# Altium schematic sheet PL_DDR4_SODIMM.SchDoc
size A3
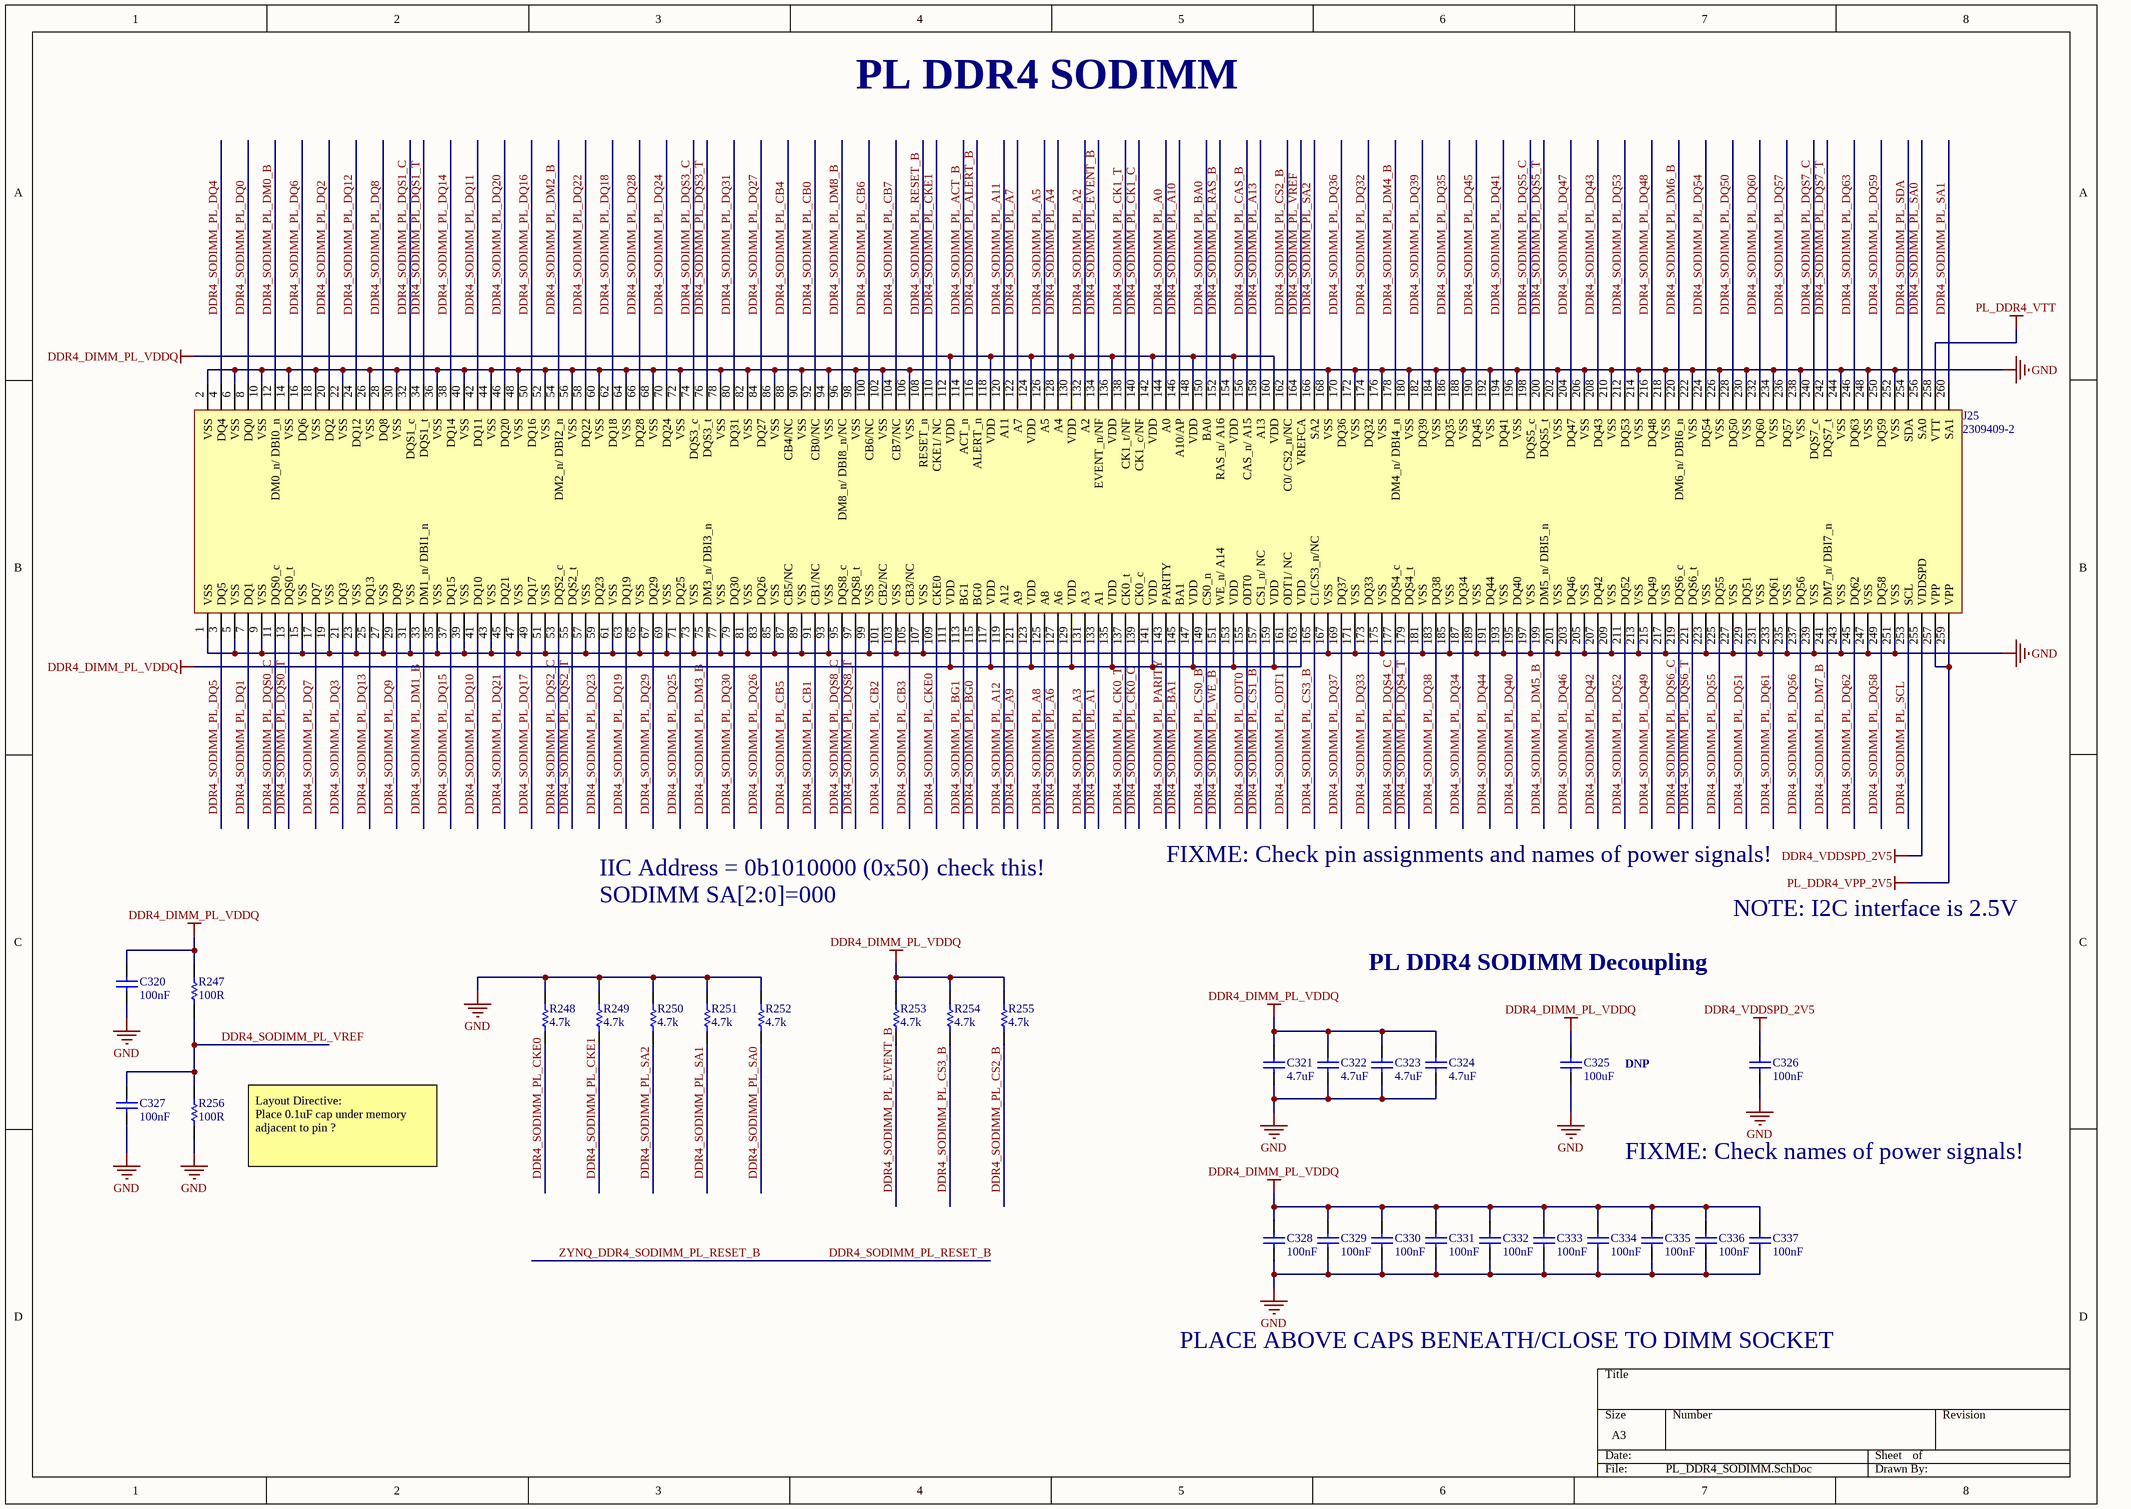
[diagram p0: PL_DDR4_SODIMM.SchDoc]

## Parts
C320  100nF  [CAPC1005L_0402]
C321  4.7uF  [CAPC1005L_0402]
C322  4.7uF  [CAPC1005L_0402]
C323  4.7uF  [CAPC1005L_0402]
C324  4.7uF  [CAPC1005L_0402]
C325  100uF  [CAPC3225N_1210]
C326  100nF  [CAPC1005L_0402]
C327  100nF  [CAPC1005L_0402]
C328  100nF  [CAPC1005L_0402]
C329  100nF  [CAPC1005L_0402]
C330  100nF  [CAPC1005L_0402]
C331  100nF  [CAPC1005L_0402]
C332  100nF  [CAPC1005L_0402]
C333  100nF  [CAPC1005L_0402]
C334  100nF  [CAPC1005L_0402]
C335  100nF  [CAPC1005L_0402]
C336  100nF  [CAPC1005L_0402]
C337  100nF  [CAPC1005L_0402]
J25  2309409-2  [DDR4_SODIMM_MATING]
R247  value 100R  [RESC1005L_0402]  (hidden comment: RES0402_100R_0W1_1T)
R248  value 4.7k  [RESC1005L_0402]  (hidden comment: RES0402_4K7_0W1_1T)
R249  value 4.7k  [RESC1005L_0402]  (hidden comment: RES0402_4K7_0W1_1T)
R250  value 4.7k  [RESC1005L_0402]  (hidden comment: RES0402_4K7_0W1_1T)
R251  value 4.7k  [RESC1005L_0402]  (hidden comment: RES0402_4K7_0W1_1T)
R252  value 4.7k  [RESC1005L_0402]  (hidden comment: RES0402_4K7_0W1_1T)
R253  value 4.7k  [RESC1005L_0402]  (hidden comment: RES0402_4K7_0W1_1T)
R254  value 4.7k  [RESC1005L_0402]  (hidden comment: RES0402_4K7_0W1_1T)
R255  value 4.7k  [RESC1005L_0402]  (hidden comment: RES0402_4K7_0W1_1T)
R256  value 100R  [RESC1005L_0402]  (hidden comment: RES0402_100R_0W1_1T)

## Nets
DDR4_DIMM_PL_VDDQ: C320.2 C321.2 C322.2 C323.2 C324.2 C325.2 C328.2 C329.2 C330.2 C331.2 C332.2 C333.2 C334.2 C335.2 C336.2 C337.2 J25.111(VDD) J25.112(VDD) J25.117(VDD) J25.118(VDD) J25.123(VDD) J25.124(VDD) J25.129(VDD) J25.130(VDD) J25.135(VDD) J25.136(VDD) J25.141(VDD) J25.142(VDD) J25.147(VDD) J25.148(VDD) J25.153(VDD) J25.154(VDD) J25.159(VDD) J25.160(VDD) J25.163(VDD) R247.2 R253.2 R254.2 R255.2
DDR4_VDDSPD_2V5: C326.2 J25.255(VDDSPD)
GND: C320.1 C321.1 C322.1 C323.1 C324.1 C325.1 C326.1 C327.1 C328.1 C329.1 C330.1 C331.1 C332.1 C333.1 C334.1 C335.1 C336.1 C337.1 J25.1(VSS) J25.2(VSS) J25.5(VSS) J25.6(VSS) J25.9(VSS) J25.10(VSS) J25.14(VSS) J25.15(VSS) J25.18(VSS) J25.19(VSS) J25.22(VSS) J25.23(VSS) J25.26(VSS) J25.27(VSS) J25.30(VSS) J25.31(VSS) J25.35(VSS) J25.36(VSS) J25.39(VSS) J25.40(VSS) J25.43(VSS) J25.44(VSS) J25.47(VSS) J25.48(VSS) J25.51(VSS) J25.52(VSS) J25.56(VSS) J25.57(VSS) J25.60(VSS) J25.61(VSS) J25.64(VSS) J25.65(VSS) J25.68(VSS) J25.69(VSS) J25.72(VSS) J25.73(VSS) J25.77(VSS) J25.78(VSS) J25.81(VSS) J25.82(VSS) J25.85(VSS) J25.86(VSS) J25.89(VSS) J25.90(VSS) J25.93(VSS) J25.94(VSS) J25.98(VSS) J25.99(VSS) J25.102(VSS) J25.103(VSS) J25.106(VSS) J25.107(VSS) J25.167(VSS) J25.168(VSS) J25.171(VSS) J25.172(VSS) J25.175(VSS) J25.176(VSS) J25.180(VSS) J25.181(VSS) J25.184(VSS) J25.185(VSS) J25.188(VSS) J25.189(VSS) J25.192(VSS) J25.193(VSS) J25.196(VSS) J25.197(VSS) J25.201(VSS) J25.202(VSS) J25.205(VSS) J25.206(VSS) J25.209(VSS) J25.210(VSS) J25.213(VSS) J25.214(VSS) J25.217(VSS) J25.218(VSS) J25.222(VSS) J25.223(VSS) J25.226(VSS) J25.227(VSS) J25.230(VSS) J25.231(VSS) J25.234(VSS) J25.235(VSS) J25.238(VSS) J25.239(VSS) J25.243(VSS) J25.244(VSS) J25.247(VSS) J25.248(VSS) J25.251(VSS) J25.252(VSS) R248.2 R249.2 R250.2 R251.2 R252.2 R256.1
PL_DDR4_VPP_2V5: J25.257(VPP) J25.259(VPP)
PL_DDR4_VTT: J25.258(VTT)
DDR4_SODIMM_PL_A0: J25.144(A0)
DDR4_SODIMM_PL_A1: J25.133(A1)
DDR4_SODIMM_PL_A2: J25.132(A2)
DDR4_SODIMM_PL_A3: J25.131(A3)
DDR4_SODIMM_PL_A4: J25.128(A4)
DDR4_SODIMM_PL_A5: J25.126(A5)
DDR4_SODIMM_PL_A6: J25.127(A6)
DDR4_SODIMM_PL_A7: J25.122(A7)
DDR4_SODIMM_PL_A8: J25.125(A8)
DDR4_SODIMM_PL_A9: J25.121(A9)
DDR4_SODIMM_PL_A10: J25.146(A10/AP)
DDR4_SODIMM_PL_A11: J25.120(A11)
DDR4_SODIMM_PL_A12: J25.119(A12)
DDR4_SODIMM_PL_A13: J25.158(A13)
DDR4_SODIMM_PL_ACT_B: J25.114(ACT_n)
DDR4_SODIMM_PL_ALERT_B: J25.116(ALERT_n)
DDR4_SODIMM_PL_BA0: J25.150(BA0)
DDR4_SODIMM_PL_BA1: J25.145(BA1)
DDR4_SODIMM_PL_BG0: J25.115(BG0)
DDR4_SODIMM_PL_BG1: J25.113(BG1)
DDR4_SODIMM_PL_CAS_B: J25.156(CAS_n/_A15)
DDR4_SODIMM_PL_CB0: J25.92(CB0/NC)
DDR4_SODIMM_PL_CB1: J25.91(CB1/NC)
DDR4_SODIMM_PL_CB2: J25.101(CB2/NC)
DDR4_SODIMM_PL_CB3: J25.105(CB3/NC)
DDR4_SODIMM_PL_CB4: J25.88(CB4/NC)
DDR4_SODIMM_PL_CB5: J25.87(CB5/NC)
DDR4_SODIMM_PL_CB6: J25.100(CB6/NC)
DDR4_SODIMM_PL_CB7: J25.104(CB7/NC)
DDR4_SODIMM_PL_CK0_C: J25.139(CK0_c)
DDR4_SODIMM_PL_CK0_T: J25.137(CK0_t)
DDR4_SODIMM_PL_CK1_C: J25.140(CK1_c/NF)
DDR4_SODIMM_PL_CK1_T: J25.138(CK1_t/NF)
DDR4_SODIMM_PL_CKE0: J25.109(CKE0) R248.1
DDR4_SODIMM_PL_CKE1: J25.110(CKE1/_NC) R249.1
DDR4_SODIMM_PL_CS0_B: J25.149(CS0_n)
DDR4_SODIMM_PL_CS1_B: J25.157(CS1_n/_NC)
DDR4_SODIMM_PL_CS2_B: J25.162(C0/_CS2_n/NC) R255.1
DDR4_SODIMM_PL_CS3_B: J25.165(C1/CS3_n/NC) R254.1
DDR4_SODIMM_PL_DM0_B: J25.12(DM0_n/_DBI0_n)
DDR4_SODIMM_PL_DM1_B: J25.33(DM1_n/_DBI1_n)
DDR4_SODIMM_PL_DM2_B: J25.54(DM2_n/_DBI2_n)
DDR4_SODIMM_PL_DM3_B: J25.75(DM3_n/_DBI3_n)
DDR4_SODIMM_PL_DM4_B: J25.178(DM4_n/_DBI4_n)
DDR4_SODIMM_PL_DM5_B: J25.199(DM5_n/_DBI5_n)
DDR4_SODIMM_PL_DM6_B: J25.220(DM6_n/_DBI6_n)
DDR4_SODIMM_PL_DM7_B: J25.241(DM7_n/_DBI7_n)
DDR4_SODIMM_PL_DM8_B: J25.96(DM8_n/_DBI8_n/NC)
DDR4_SODIMM_PL_DQ0: J25.8(DQ0)
DDR4_SODIMM_PL_DQ1: J25.7(DQ1)
DDR4_SODIMM_PL_DQ2: J25.20(DQ2)
DDR4_SODIMM_PL_DQ3: J25.21(DQ3)
DDR4_SODIMM_PL_DQ4: J25.4(DQ4)
DDR4_SODIMM_PL_DQ5: J25.3(DQ5)
DDR4_SODIMM_PL_DQ6: J25.16(DQ6)
DDR4_SODIMM_PL_DQ7: J25.17(DQ7)
DDR4_SODIMM_PL_DQ8: J25.28(DQ8)
DDR4_SODIMM_PL_DQ9: J25.29(DQ9)
DDR4_SODIMM_PL_DQ10: J25.41(DQ10)
DDR4_SODIMM_PL_DQ11: J25.42(DQ11)
DDR4_SODIMM_PL_DQ12: J25.24(DQ12)
DDR4_SODIMM_PL_DQ13: J25.25(DQ13)
DDR4_SODIMM_PL_DQ14: J25.38(DQ14)
DDR4_SODIMM_PL_DQ15: J25.37(DQ15)
DDR4_SODIMM_PL_DQ16: J25.50(DQ16)
DDR4_SODIMM_PL_DQ17: J25.49(DQ17)
DDR4_SODIMM_PL_DQ18: J25.62(DQ18)
DDR4_SODIMM_PL_DQ19: J25.63(DQ19)
DDR4_SODIMM_PL_DQ20: J25.46(DQ20)
DDR4_SODIMM_PL_DQ21: J25.45(DQ21)
DDR4_SODIMM_PL_DQ22: J25.58(DQ22)
DDR4_SODIMM_PL_DQ23: J25.59(DQ23)
DDR4_SODIMM_PL_DQ24: J25.70(DQ24)
DDR4_SODIMM_PL_DQ25: J25.71(DQ25)
DDR4_SODIMM_PL_DQ26: J25.83(DQ26)
DDR4_SODIMM_PL_DQ27: J25.84(DQ27)
DDR4_SODIMM_PL_DQ28: J25.66(DQ28)
DDR4_SODIMM_PL_DQ29: J25.67(DQ29)
DDR4_SODIMM_PL_DQ30: J25.79(DQ30)
DDR4_SODIMM_PL_DQ31: J25.80(DQ31)
DDR4_SODIMM_PL_DQ32: J25.174(DQ32)
DDR4_SODIMM_PL_DQ33: J25.173(DQ33)
DDR4_SODIMM_PL_DQ34: J25.187(DQ34)
DDR4_SODIMM_PL_DQ35: J25.186(DQ35)
DDR4_SODIMM_PL_DQ36: J25.170(DQ36)
DDR4_SODIMM_PL_DQ37: J25.169(DQ37)
DDR4_SODIMM_PL_DQ38: J25.183(DQ38)
DDR4_SODIMM_PL_DQ39: J25.182(DQ39)
DDR4_SODIMM_PL_DQ40: J25.195(DQ40)
DDR4_SODIMM_PL_DQ41: J25.194(DQ41)
DDR4_SODIMM_PL_DQ42: J25.207(DQ42)
DDR4_SODIMM_PL_DQ43: J25.208(DQ43)
DDR4_SODIMM_PL_DQ44: J25.191(DQ44)
DDR4_SODIMM_PL_DQ45: J25.190(DQ45)
DDR4_SODIMM_PL_DQ46: J25.203(DQ46)
DDR4_SODIMM_PL_DQ47: J25.204(DQ47)
DDR4_SODIMM_PL_DQ48: J25.216(DQ48)
DDR4_SODIMM_PL_DQ49: J25.215(DQ49)
DDR4_SODIMM_PL_DQ50: J25.228(DQ50)
DDR4_SODIMM_PL_DQ51: J25.229(DQ51)
DDR4_SODIMM_PL_DQ52: J25.211(DQ52)
DDR4_SODIMM_PL_DQ53: J25.212(DQ53)
DDR4_SODIMM_PL_DQ54: J25.224(DQ54)
DDR4_SODIMM_PL_DQ55: J25.225(DQ55)
DDR4_SODIMM_PL_DQ56: J25.237(DQ56)
DDR4_SODIMM_PL_DQ57: J25.236(DQ57)
DDR4_SODIMM_PL_DQ58: J25.249(DQ58)
DDR4_SODIMM_PL_DQ59: J25.250(DQ59)
DDR4_SODIMM_PL_DQ60: J25.232(DQ60)
DDR4_SODIMM_PL_DQ61: J25.233(DQ61)
DDR4_SODIMM_PL_DQ62: J25.245(DQ62)
DDR4_SODIMM_PL_DQ63: J25.246(DQ63)
DDR4_SODIMM_PL_DQS0_C: J25.11(DQS0_c)
DDR4_SODIMM_PL_DQS0_T: J25.13(DQS0_t)
DDR4_SODIMM_PL_DQS1_C: J25.32(DQS1_c)
DDR4_SODIMM_PL_DQS1_T: J25.34(DQS1_t)
DDR4_SODIMM_PL_DQS2_C: J25.53(DQS2_c)
DDR4_SODIMM_PL_DQS2_T: J25.55(DQS2_t)
DDR4_SODIMM_PL_DQS3_C: J25.74(DQS3_c)
DDR4_SODIMM_PL_DQS3_T: J25.76(DQS3_t)
DDR4_SODIMM_PL_DQS4_C: J25.177(DQS4_c)
DDR4_SODIMM_PL_DQS4_T: J25.179(DQS4_t)
DDR4_SODIMM_PL_DQS5_C: J25.198(DQS5_c)
DDR4_SODIMM_PL_DQS5_T: J25.200(DQS5_t)
DDR4_SODIMM_PL_DQS6_C: J25.219(DQS6_c)
DDR4_SODIMM_PL_DQS6_T: J25.221(DQS6_t)
DDR4_SODIMM_PL_DQS7_C: J25.240(DQS7_c)
DDR4_SODIMM_PL_DQS7_T: J25.242(DQS7_t)
DDR4_SODIMM_PL_DQS8_C: J25.95(DQS8_c)
DDR4_SODIMM_PL_DQS8_T: J25.97(DQS8_t)
DDR4_SODIMM_PL_EVENT_B: J25.134(EVENT_n/NF) R253.1
DDR4_SODIMM_PL_ODT0: J25.155(ODT0)
DDR4_SODIMM_PL_ODT1: J25.161(ODT1/_NC)
DDR4_SODIMM_PL_PARITY: J25.143(PARITY)
DDR4_SODIMM_PL_RAS_B: J25.152(RAS_n/_A16)
DDR4_SODIMM_PL_RESET_B: J25.108(RESET_n)  [also labelled ZYNQ_DDR4_SODIMM_PL_RESET_B]
DDR4_SODIMM_PL_SA0: J25.256(SA0) R252.1
DDR4_SODIMM_PL_SA1: J25.260(SA1) R251.1
DDR4_SODIMM_PL_SA2: J25.166(SA2) R250.1
DDR4_SODIMM_PL_SCL: J25.253(SCL)
DDR4_SODIMM_PL_SDA: J25.254(SDA)
DDR4_SODIMM_PL_VREF: C327.2 J25.164(VREFCA) R247.1 R256.2
DDR4_SODIMM_PL_WE_B: J25.151(WE_n/_A14)

## Notes on the sheet
- PL DDR4 SODIMM
- IIC Address = 0b1010000 (0x50)
- SODIMM SA[2:0]=000
- check this!
- FIXME: Check pin assignments and names of power signals!
- NOTE: I2C interface is 2.5V
- PL DDR4 SODIMM Decoupling
- DNP
- Layout Directive:
  Place 0.1uF cap under memory
  adjacent to pin ?
- FIXME: Check names of power signals!
- PLACE ABOVE CAPS BENEATH/CLOSE TO DIMM SOCKET

## Library data of the parts
C320 C326-C337 = CAPCER0402X7R100N25V_10T: CAP CER 0.1UF 25V X7R 0402; Manufacturer 1: Murata Electronics North America; Manufacturer Part Number 1: GRM155R71E104KE14D; Tolerance: 10%; Package: 0402; ComponentLink1Description: Datasheet; Value: 100nF; Voltage: 25V; Temperature Coefficient: X7R; Supplier 1: Digi-Key; Supplier Part Number 1: 490-10698-1-ND; Operating Temperature: -55°C ~ 125°C
C321-C324 = CAPCER0402X5R4U710V_10T: CAP CER 4.7UF 10V X5R 0402; Manufacturer 1: TDK Corporation; Manufacturer Part Number 1: C1005X5R1A475K050BC; Tolerance: 10%; Package: 0402; ComponentLink1Description: Datasheet; Value: 4.7uF; Voltage: 10V; Temperature Coefficient: x5R; Supplier 1: Digi-Key; Supplier Part Number 1: 445-13820-1-ND; Operating Temperature: -55°C ~ 85°C
C325 = CAPCER1210X5R100U16V_20T: CAP CER 100UF 16V X5R 1210; Manufacturer 1: Taiyo Yuden; Manufacturer Part Number 1: EMK325ABJ107MM-T; Tolerance: 20%; Package: 1210; ComponentLink1Description: Datasheet; Value: 100uF; Voltage: 16V; Temperature Coefficient: X5R; Supplier 1: Digi-Key; Supplier Part Number 1: 587-3152-1-ND; Operating Temperature: -55°C ~ 85°C
J25 = 2309409-2: DDR4 SODIMM 260P 5.2H STD; Manufacturer 1: TE; ComponentLink1Description: Datasheet; ComponentLink1URL: C:\Users\Public\Documents\Altium\AD16\Library\PDF\ENG_CD_2309409_3.pdf; Supplier 1: Digi-Key; Manufacturer Part Number 1: 2309409-2; Operating Temperature: -55 – 85 °C; Height: 5.2mm
R247 R256 = RES0402_100R_0W1_1T: RES SMD 100 OHM 1% 1/10W 0402; Manufacturer 1: Panasonic Electronic Components; Manufacturer Part Number 1: ERJ-2RKF1000X; Package: 0402; ComponentLink1Description: Datasheet; Power: 1/10W; Tolerance: 1%; Supplier 1: Digi-Key; Supplier Part Number 1: P100LCT-ND
R248-R255 = RES0402_4K7_0W1_1T: RES SMD 4.7K OHM 1% 1/10W 0402; Manufacturer 1: Panasonic Electronic Components; Manufacturer Part Number 1: ERJ-2RKF4701X; Package: 0402; ComponentLink1Description: Datasheet; Power: 1/10W; Tolerance: 1%; Supplier 1: Digi-Key; Supplier Part Number 1: P4.70KLCT-ND